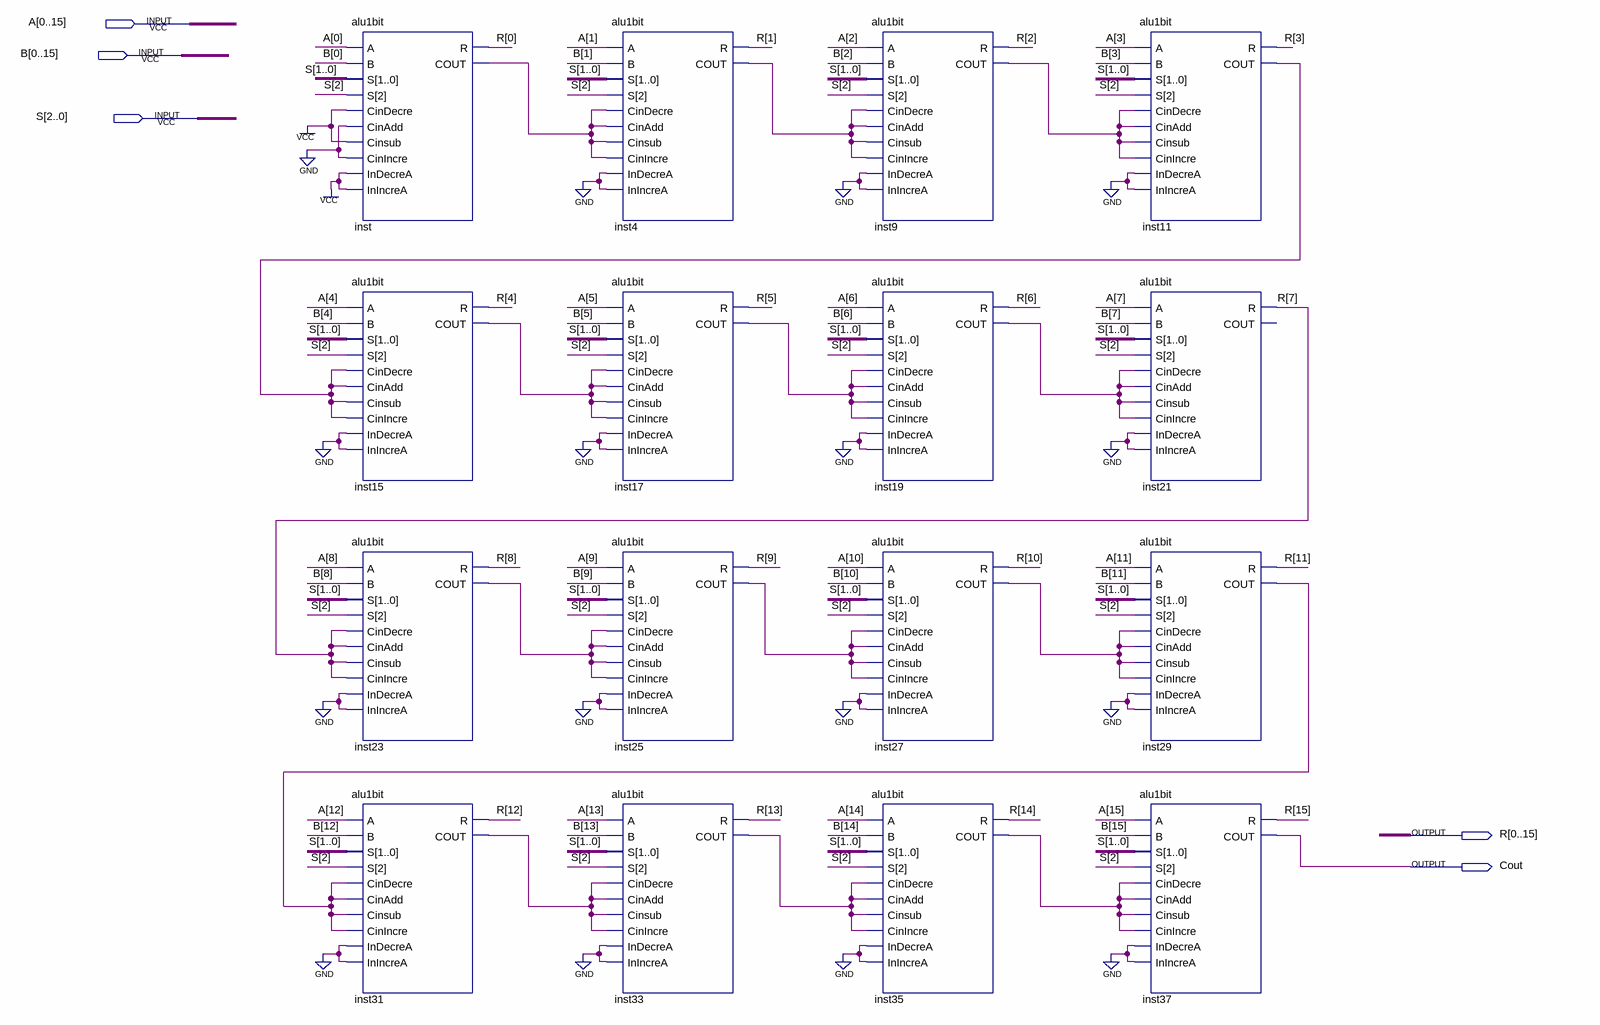
[diagram p0: schematic sheet]
// Quartus schematic alu16bit.bdf as structural Verilog: 16 symbols, 5 pins
module alu16bit (
  input  [0:15] A,
  input  [0:15] B,
  input  [2:0] S,
  output [0:15] R,
  output Cout
);

  wire inst4_cout, inst9_cout, inst11_cout, inst15_cout, inst17_cout, inst19_cout, inst23_cout, inst25_cout,
       inst27_cout, inst29_cout, inst31_cout, inst33_cout, inst35_cout, inst_cout;

  alu1bit inst (
    .A(A[0]), .B(B[0]), .S(S), .CinDecre(1'b1), .CinAdd(1'b0), .Cinsub(1'b1), .CinIncre(1'b0),
    .InDecreA(1'b1), .InIncreA(1'b1), .R(R[0]), .COUT(inst_cout));
  alu1bit inst15 (
    .A(A[4]), .B(B[4]), .S(S), .CinDecre(inst11_cout), .CinAdd(inst11_cout), .Cinsub(inst11_cout),
    .CinIncre(inst11_cout), .InDecreA(1'b0), .InIncreA(1'b0), .R(R[4]), .COUT(inst15_cout));
  alu1bit inst23 (
    .A(A[8]), .B(B[8]), .S(S), .CinDecre(R[7]), .CinAdd(R[7]), .Cinsub(R[7]), .CinIncre(R[7]),
    .InDecreA(1'b0), .InIncreA(1'b0), .R(R[8]), .COUT(inst23_cout));
  alu1bit inst31 (
    .A(A[12]), .B(B[12]), .S(S), .CinDecre(inst29_cout), .CinAdd(inst29_cout), .Cinsub(inst29_cout),
    .CinIncre(inst29_cout), .InDecreA(1'b0), .InIncreA(1'b0), .R(R[12]), .COUT(inst31_cout));
  alu1bit inst4 (
    .A(A[1]), .B(B[1]), .S(S), .CinDecre(inst_cout), .CinAdd(inst_cout), .Cinsub(inst_cout),
    .CinIncre(inst_cout), .InDecreA(1'b0), .InIncreA(1'b0), .R(R[1]), .COUT(inst4_cout));
  alu1bit inst17 (
    .A(A[5]), .B(B[5]), .S(S), .CinDecre(inst15_cout), .CinAdd(inst15_cout), .Cinsub(inst15_cout),
    .CinIncre(inst15_cout), .InDecreA(1'b0), .InIncreA(1'b0), .R(R[5]), .COUT(inst17_cout));
  alu1bit inst25 (
    .A(A[9]), .B(B[9]), .S(S), .CinDecre(inst23_cout), .CinAdd(inst23_cout), .Cinsub(inst23_cout),
    .CinIncre(inst23_cout), .InDecreA(1'b0), .InIncreA(1'b0), .R(R[9]), .COUT(inst25_cout));
  alu1bit inst33 (
    .A(A[13]), .B(B[13]), .S(S), .CinDecre(inst31_cout), .CinAdd(inst31_cout), .Cinsub(inst31_cout),
    .CinIncre(inst31_cout), .InDecreA(1'b0), .InIncreA(1'b0), .R(R[13]), .COUT(inst33_cout));
  alu1bit inst9 (
    .A(A[2]), .B(B[2]), .S(S), .CinDecre(inst4_cout), .CinAdd(inst4_cout), .Cinsub(inst4_cout),
    .CinIncre(inst4_cout), .InDecreA(1'b0), .InIncreA(1'b0), .R(R[2]), .COUT(inst9_cout));
  alu1bit inst19 (
    .A(A[6]), .B(B[6]), .S(S), .CinDecre(inst17_cout), .CinAdd(inst17_cout), .Cinsub(inst17_cout),
    .CinIncre(inst17_cout), .InDecreA(1'b0), .InIncreA(1'b0), .R(R[6]), .COUT(inst19_cout));
  alu1bit inst27 (
    .A(A[10]), .B(B[10]), .S(S), .CinDecre(inst25_cout), .CinAdd(inst25_cout), .Cinsub(inst25_cout),
    .CinIncre(inst25_cout), .InDecreA(1'b0), .InIncreA(1'b0), .R(R[10]), .COUT(inst27_cout));
  alu1bit inst35 (
    .A(A[14]), .B(B[14]), .S(S), .CinDecre(inst33_cout), .CinAdd(inst33_cout), .Cinsub(inst33_cout),
    .CinIncre(inst33_cout), .InDecreA(1'b0), .InIncreA(1'b0), .R(R[14]), .COUT(inst35_cout));
  alu1bit inst11 (
    .A(A[3]), .B(B[3]), .S(S), .CinDecre(inst9_cout), .CinAdd(inst9_cout), .Cinsub(inst9_cout),
    .CinIncre(inst9_cout), .InDecreA(1'b0), .InIncreA(1'b0), .R(R[3]), .COUT(inst11_cout));
  alu1bit inst21 (
    .A(A[7]), .B(B[7]), .S(S), .CinDecre(inst19_cout), .CinAdd(inst19_cout), .Cinsub(inst19_cout),
    .CinIncre(inst19_cout), .InDecreA(1'b0), .InIncreA(1'b0), .R(R[7]));  // open: COUT
  alu1bit inst29 (
    .A(A[11]), .B(B[11]), .S(S), .CinDecre(inst27_cout), .CinAdd(inst27_cout), .Cinsub(inst27_cout),
    .CinIncre(inst27_cout), .InDecreA(1'b0), .InIncreA(1'b0), .R(R[11]), .COUT(inst29_cout));
  alu1bit inst37 (
    .A(A[15]), .B(B[15]), .S(S), .CinDecre(inst35_cout), .CinAdd(inst35_cout), .Cinsub(inst35_cout),
    .CinIncre(inst35_cout), .InDecreA(1'b0), .InIncreA(1'b0), .R(R[15]), .COUT(Cout));
endmodule
